# EAGLE schematic vga_ambilight_throughhole (EAGLE 6.1)
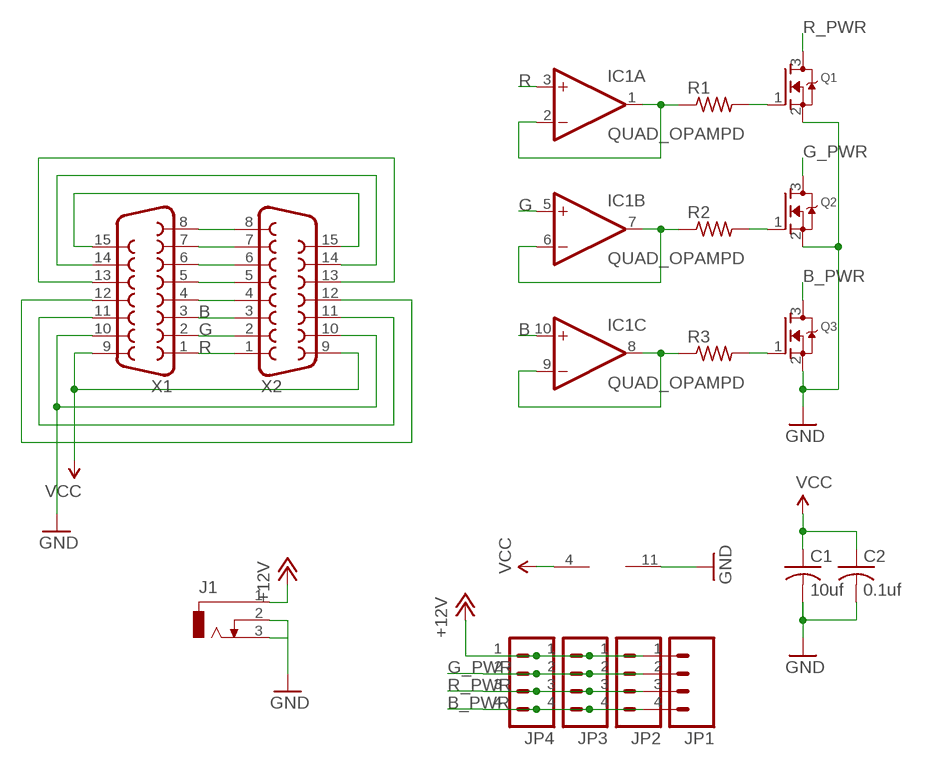
[diagram p0: schematic, sheet 1]

## Parts
C1  10uf  C-USC1206  [C1206]
C2  0.1uf  C-USC1206  [C1206]
IC1  QUAD_OPAMPD  [SO14]
J1  DCJ0303  [DCJ0303]
JP1  M04PTH  [1X04]
JP2  M04PTH  [1X04]
JP3  M04PTH  [1X04]
JP4  M04PTH  [1X04]
Q1  MOSFET-NREFLOW  [SOT23]
Q2  MOSFET-NREFLOW  [SOT23]
Q3  MOSFET-NREFLOW  [SOT23]
R1  R-US_M0805  [M0805]
R2  R-US_M0805  [M0805]
R3  R-US_M0805  [M0805]
X1  F15HP  [F15HP]
X2  F15HP  [F15HP]

## Nets
+12V: J1.1 JP1.1 JP2.1 JP3.1 JP4.1
B: IC1.10(C:+IN) X1.3 X2.3
B_PWR: JP1.4 JP2.4 JP3.4 JP4.4 Q3.3(D)
G: IC1.5(B:+IN) X1.2 X2.2
G_PWR: JP1.2 JP2.2 JP3.2 JP4.2 Q2.3(D)
GND: C1.2 C2.2 IC1.11(P:V-) J1.2 J1.3 Q1.2(S) Q2.2(S) Q3.2(S) X1.10 X2.10
N$1: X1.4 X2.4
N$2: X1.5 X2.5
N$3: X1.6 X2.6
N$4: X1.7 X2.7
N$5: X1.8 X2.8
N$6: IC1.8(C:OUT) IC1.9(C:-IN) R3.1
N$7: IC1.6(B:-IN) IC1.7(B:OUT) R2.1
N$8: IC1.1(A:OUT) IC1.2(A:-IN) R1.1
N$9: X1.15 X2.15
N$10: X1.14 X2.14
N$11: X1.13 X2.13
N$12: Q1.1(G) R1.2
N$13: Q2.1(G) R2.2
N$14: X1.11 X2.11
N$15: X1.12 X2.12
N$16: Q3.1(G) R3.2
R: IC1.3(A:+IN) X1.1 X2.1
R_PWR: JP1.3 JP2.3 JP3.3 JP4.3 Q1.3(D)
VCC: C1.1 C2.1 IC1.4(P:V+) X1.9 X2.9
Unconnected: IC1.12(D:+IN) IC1.13(D:-IN) IC1.14(D:OUT)

## Library data of the parts
C1 C2 = adafruit:C-US: CAPACITOR, American symbol
IC1 = adafruit:QUAD_OPAMP: OP AMP Standard quad package
J1 = con-jack:DCJ0303: DC POWER JACK Source: DCJ0303.pdf; OC_FARNELL: unknown; OC_NEWARK: unknown
JP1-JP4 = sparkfun:M04: Header 4 Standard 4-pin 0.1" header. Use with straight break away headers (SKU : PRT-00116), right angle break away headers (PRT-00553), swiss pins (PRT-00743), machine pins (PRT-00117), and female headers (PRT-00115). Molex polarized connector foot print use with SKU : PRT-08231 with associated crimp pins and housings. 1MM SMD Version SKU: PRT-10208
Q1-Q3 = adafruit:MOSFET-N: N-Channel Mosfet 2N7002E - 60V 260mA SOT23 [Digikey: 2N7002ET1GOSTR-ND] - REEL BSH103 - 30V 850mA SOT23 [Digikey: 568-5013-1-ND]
R1-R3 = adafruit:R-US_: RESISTOR, American symbol
X1 X2 = adafruit:F15: SUB-D HDH is also known as a 'right angle VGA' connector